# Altium schematic sheet omnibothub-power-two.SchDoc
size A4
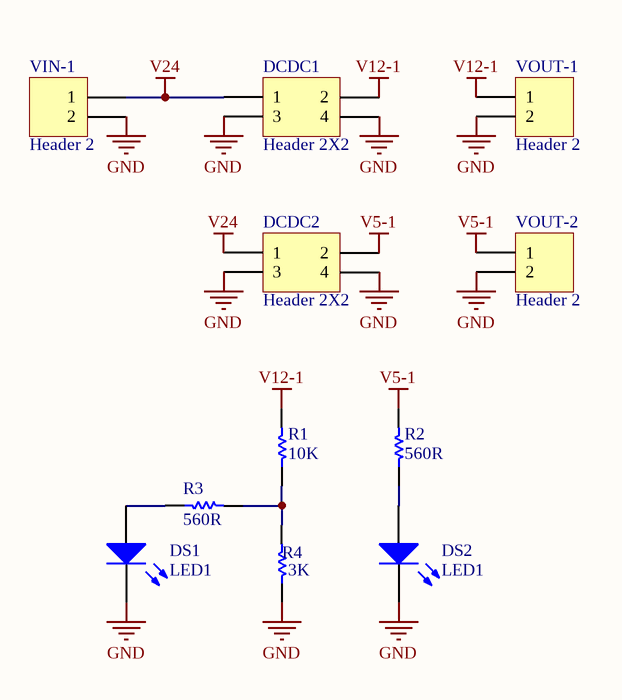
[diagram p0: omnibothub-power-two.SchDoc]

## Parts
DCDC1  Header 2X2  [DCDC-1]
DCDC2  Header 2X2  [DCDC-1]
DS1  LED1  [SMDLED]
DS2  LED1  [SMDLED]
R1  10K  [R0805]
R2  560R  [R0603]
R3  560R  [R0603]
R4  3K  [R0805]
VIN-1  Header 2  [AMASS-XT30PW-M]
VOUT-1  Header 2  [AMASS-XT30PW-M]
VOUT-2  Header 2  [AMASS-XT30PW-M]

## Nets
GND: DCDC1.3 DCDC1.4 DCDC2.3 DCDC2.4 DS1.2(K) DS2.2(K) R4.1 VIN-1.2 VOUT-1.2 VOUT-2.2
V5-1: DCDC2.2 R2.2 VOUT-2.1
V12-1: DCDC1.2 R1.2 VOUT-1.1
V24: DCDC1.1 DCDC2.1 VIN-1.1
NetDS1_1: DS1.1(A) R3.1
NetDS2_1: DS2.1(A) R2.1
NetR1_1: R1.1 R3.2 R4.2

## Library data of the parts
DCDC1 DCDC2 = Header 2X2: Header, 2-Pin, Dual row; LatestRevisionDate: 17-Jul-2002; LatestRevisionNote: Re-released for DXP Platform.; Publisher: Altium Limited
DS1 DS2 = LED2: Typical RED, GREEN, YELLOW, AMBER GaAs LED; Published: 8-Jun-2000; LatestRevisionDate: 17-Jul-2002; LatestRevisionNote: Re-released for DXP Platform.; PackageDocument: Feb-2002; PackageReference: 3.2X1.6X1.1; Publisher: Altium Limited
R1-R4 = Res2: 0603
VIN-1 VOUT-1 VOUT-2 = Header 2: Header, 2-Pin; LatestRevisionDate: 17-Jul-2002; LatestRevisionNote: Re-released for DXP Platform.; Publisher: Altium Limited